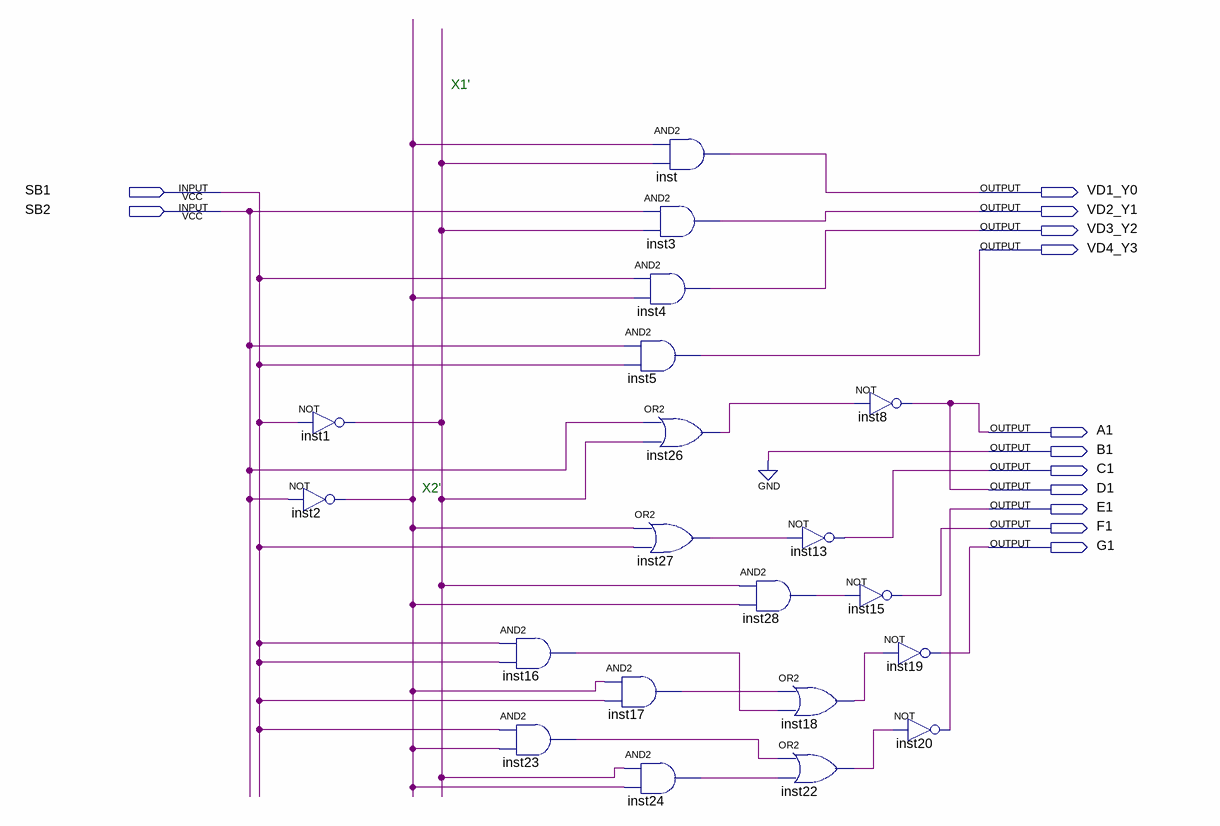
[diagram p0: schematic sheet]
// Quartus schematic BF3.bdf as structural Verilog: 20 symbols, 13 pins
module BF3 (
  input  SB1,
  input  SB2,
  output VD1_Y0,
  output VD2_Y1,
  output VD3_Y2,
  output VD4_Y3,
  output A1,
  output B1,
  output C1,
  output D1,
  output E1,
  output F1,
  output G1
);

  wire inst1_out, inst2_out, inst16_out, inst17_out, inst18_out, inst22_out, inst23_out, inst24_out,
       inst26_out, inst27_out, inst28_out;

  not inst2 (inst2_out, SB2);
  not inst1 (inst1_out, SB1);
  and inst16 (inst16_out, SB1, SB1);
  and inst23 (inst23_out, SB1, inst2_out);
  and inst (VD1_Y0, inst2_out, inst1_out);
  and inst3 (VD2_Y1, SB2, inst1_out);
  and inst4 (VD3_Y2, SB1, inst2_out);
  and inst5 (VD4_Y3, SB2, SB1);
  or inst26 (inst26_out, SB2, inst1_out);
  or inst27 (inst27_out, inst2_out, SB1);
  and inst17 (inst17_out, inst2_out, SB1);
  and inst24 (inst24_out, inst1_out, inst2_out);
  and inst28 (inst28_out, inst1_out, inst2_out);
  not inst13 (C1, inst27_out);
  or inst18 (inst18_out, inst17_out, inst16_out);
  or inst22 (inst22_out, inst23_out, inst24_out);
  not inst8 (A1, inst26_out);
  not inst15 (F1, inst28_out);
  not inst19 (G1, inst18_out);
  not inst20 (E1, inst22_out);

  assign B1 = 1'b0;
  assign D1 = A1;

  // Notes on the sheet:
  //   X1'
  //   X2'
endmodule
